# EAGLE design shield nodemcu (EAGLE 7.2.0)
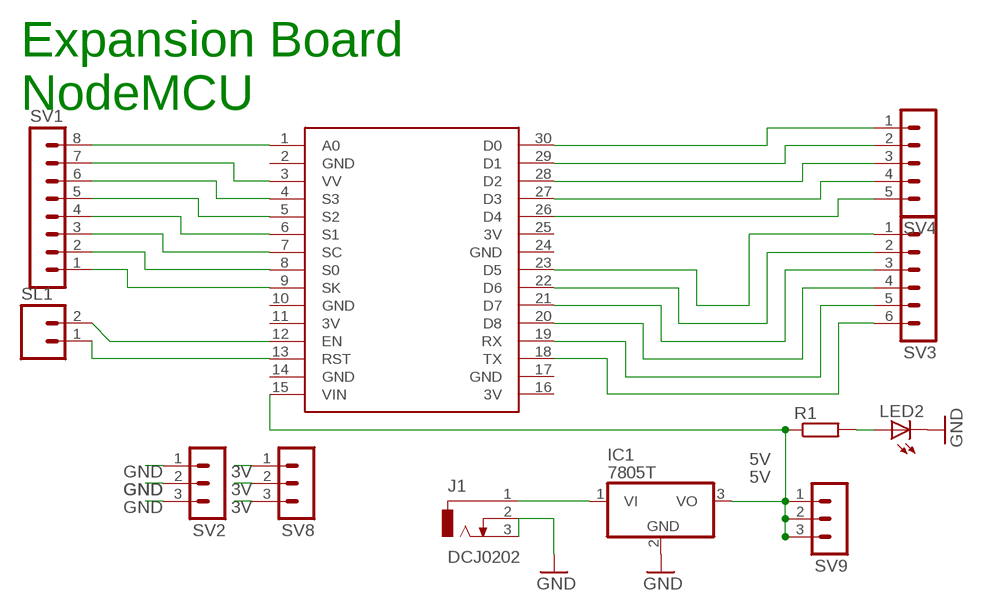
[diagram p0: schematic, sheet 1]

## Parts
IC1  7805T  [TO220H]
J1  DCJ0202  [DCJ0202]
LED2  LED5MM  [LED5MM]
R1  R-EU_0207/10  [0207/10]
SL1  M02  [02P]
SV1  MA08-1  [MA08-1]
SV2  MA03-1  [MA03-1]
SV3  MA06-1  [MA06-1]
SV4  MA05-1  [MA05-1]
SV8  MA03-1  [MA03-1]
SV9  MA03-1  [MA03-1]
U$1  NODEMCU  [NODEMCU]

## Nets
3V: SV8.1 SV8.2 SV8.3
5V: IC1.3(VO) R1.1 SV9.1 SV9.2 SV9.3 U$1.15(VIN)
GND: IC1.2(GND) J1.2 J1.3 LED2.K(C) SV2.1 SV2.2 SV2.3
N$3: SV4.5 U$1.26(D4)
N$4: SV1.8 U$1.1(A0)
N$5: SV1.7 U$1.3(VV)
N$6: SV1.6 U$1.4(S3)
N$7: SV1.5 U$1.5(S2)
N$8: LED2.A R1.2
N$9: SV1.3 U$1.7(SC)
N$10: IC1.1(VI) J1.1
N$11: SV1.1 U$1.9(SK)
N$12: SL1.1 U$1.13(RST)
N$13: SL1.2 U$1.12(EN)
N$14: SV4.1 U$1.30(D0)
N$15: SV4.2 U$1.29(D1)
N$16: SV4.3 U$1.28(D2)
N$17: SV4.4 U$1.27(D3)
N$18: SV3.1 U$1.23(D5)
N$19: SV3.2 U$1.22(D6)
N$20: SV3.3 U$1.21(D7)
N$21: SV3.4 U$1.20(D8)
N$22: SV3.5 U$1.19(RX)
N$23: SV3.6 U$1.18(TX)
N$28: SV1.4 U$1.6(S1)
N$29: SV1.2 U$1.8(S0)

## Notes on the sheet
- Expansion Board
- NodeMCU

## Power pins joined to a net without a drawn wire
3V: U$1.11(3V) U$1.16(3V) U$1.25(3V)
GND: U$1.2(GND) U$1.10(GND) U$1.14(GND) U$1.17(GND) U$1.24(GND)

## Library data of the parts
IC1 = linear:78*: Positive VOLTAGE REGULATOR Source: http://cache.national.com/ds/LM/LM78L05.pdf http://www.fairchildsemi.com/ds/LM/LM7805.pdf
J1 = con-jack:DCJ0202: DC POWER JACK Source: DCJ0202.pdf; OC_FARNELL: unknown; OC_NEWARK: unknown
LED2 = led:LED: LED OSRAM: - CHIPLED LG R971, LG N971, LY N971, LG Q971, LY Q971, LO R971, LY R971 LH N974, LH R974 LS Q976, LO Q976, LY Q976 LO Q996 - Hyper CHIPLED LW Q18S LB Q993, LB Q99A, LB R99A - SideLED LS A670, LO A670, LY A670, LG A670, LP A670 LB A673, LV A673, LT A673, LW A673 LH A674 LY A675 LS A676, LA A676, LO A676, LY A676, LW A676 LS A679, LY A679, LG A679 - Hyper Micro SIDELED® LS Y876, LA Y876, LO Y876, LY Y876 LT Y87S - SmartLED LW L88C, LW L88S LB L89C, LB L89S, LG L890 LS L89K, LO L89K, LY L89K LS L896, LA L896, LO L896, LY L896 - TOPLED LS T670, LO T670, LY T670, LG T670, LP T670 LSG T670, LSP T670, LSY T670, LOP T670, LYG T670 LG T671, LOG T671, LSG T671 LB T673, LV T673, LT T673, LW T673 LH T674 LS T676, LA T676, LO T676, LY T676, LB T676, LH T676, LSB T676, LW T676 LB T67C, LV T67C, LT T67C, LS T67K, LO T67K, LY T67K, LW E67C LS E67B, LA E67B, LO E67B, LY E67B, LB E67C, LV E67C, LT E67C LW T67C LS T679, LY T679, LG T679 LS T770, LO T770, LY T770, LG T770, LP T770 LB T773, LV T773, LT T773, LW T773 LH T774 LS E675, LA E675, LY E675, LS T675 LS T776, LA T776, LO T776, LY T776, LB T776 LHGB T686 LT T68C, LB T68C - Hyper Mini TOPLED® LB M676 - Mini TOPLED Santana® LG M470 LS M47K, LO M47K, LY M47K Source: http://www.osram.convergy.de LUXEON: - LUMILED® LXK2-PW12-R00, LXK2-PW12-S00, LXK2-PW14-U00, LXK2-PW14-V00 LXK2-PM12-R00, LXK2-PM12-S00, LXK2-PM14-U00 LXK2-PE12-Q00, LXK2-PE12-R00, LXK2-PE12-S00, LXK2-PE14-T00, LXK2-PE14-U00 LXK2-PB12-K00, LXK2-PB12-L00, LXK2-PB12-M00, LXK2-PB14-N00, LXK2-PB14-P00, LXK2-PB14-Q00 LXK2-PR12-L00, LXK2-PR12-M00, LXK2-PR14-Q00, LXK2-PR14-R00 LXK2-PD12-Q00, LXK2-PD12-R00, LXK2-PD12-S00 LXK2-PH12-R00, LXK2-PH12-S00 LXK2-PL12-P00, LXK2-PL12-Q00, LXK2-PL12-R00 Source: www.luxeon.com KINGBRIGHT: KA-3528ASYC Source: www.kingbright.com
R1 = resistor:R-EU_: RESISTOR, European symbol
SL1 = con-amp-quick:M02: AMP QUICK CONNECTOR; OC_FARNELL: unknown; OC_NEWARK: unknown
SV1 = con-lstb:MA08-1: PIN HEADER; OC_FARNELL: unknown; OC_NEWARK: unknown
SV2 SV8 SV9 = con-lstb:MA03-1: PIN HEADER; OC_FARNELL: unknown; OC_NEWARK: unknown
SV3 = con-lstb:MA06-1: PIN HEADER; OC_FARNELL: unknown; OC_NEWARK: unknown
SV4 = con-lstb:MA05-1: PIN HEADER; OC_FARNELL: unknown; OC_NEWARK: unknown
U$1 = nodemcu:NODEMCU

## Board
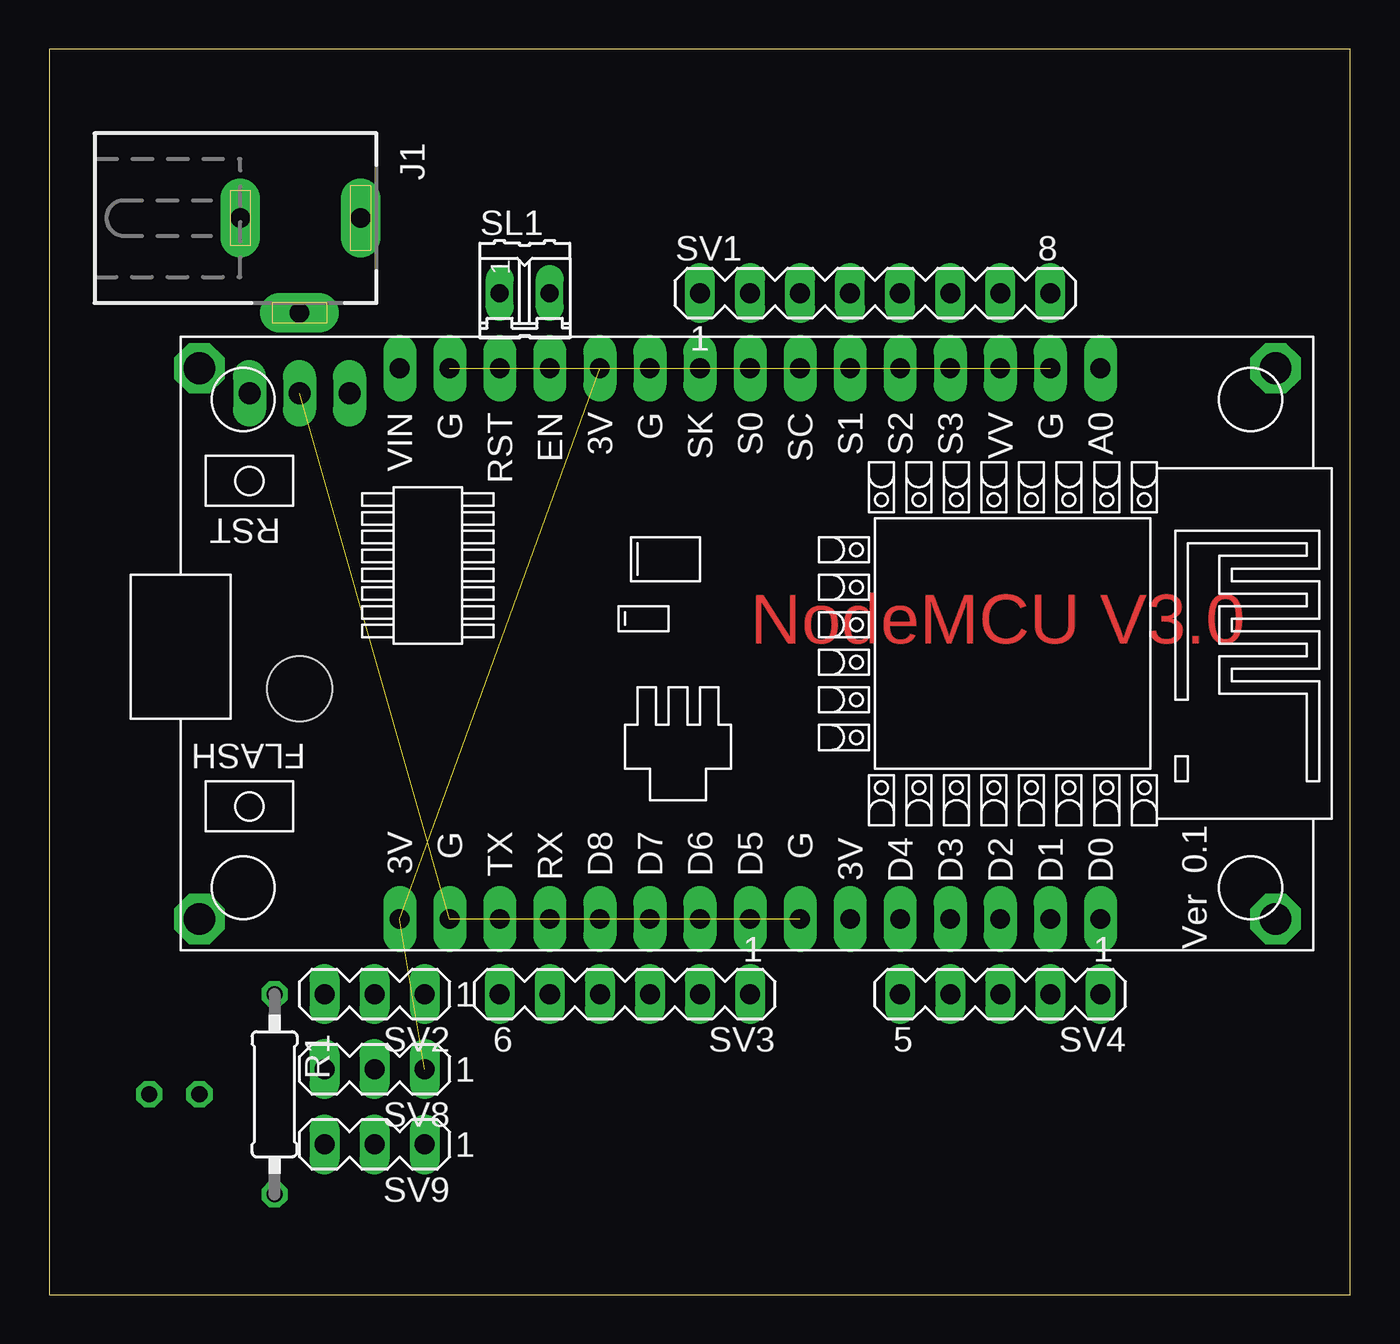
[diagram p1: board, top side]
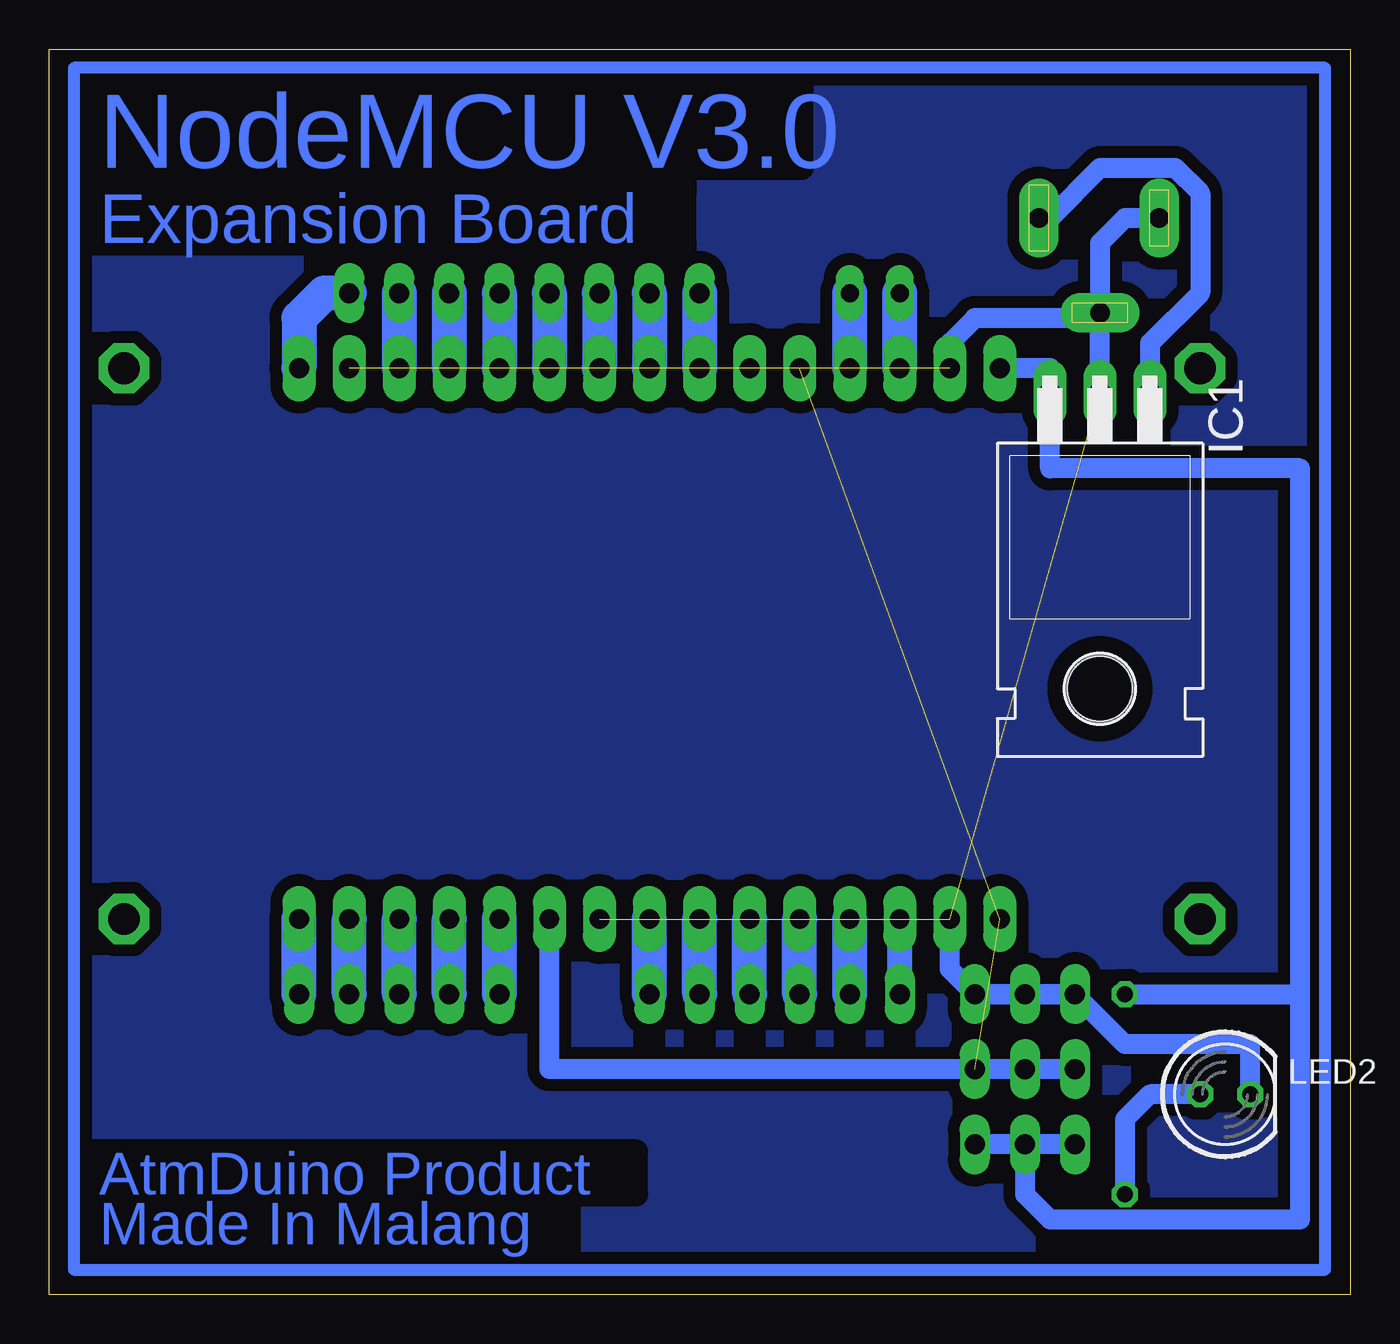
[diagram p2: board, bottom side, seen from below]

Size 66.02 x 63.17 mm. Coordinates in mm from the lower left corner, seen from the top.
Outline: 0,0 66.02,0 66.02,63.17 0,63.17 0,0
Copper layers (1*16): Top 0.035mm / dielectric 1.5mm / Bottom 0.035mm
Design rules "default": minimum track width 10mil, minimum drill 24mil, track to track 8mil, track to pad 8mil, pad to pad 8mil, via to via 8mil, smd to smd 8mil, copper to edge 40mil, drill to drill 8mil, minimum pad ring 10mil, minimum via ring 8mil, stop-mask expansion 4mil, vias tented up to drill 0mil, thermal gap 10mil

### Footprints (pad centres in the part's own frame; a part is rotated, then mirrored left to right if it is on the bottom)
TO220H = drill 1.118 long: 1 -2.54,-10.16; 2 0,-10.16; 3 2.54,-10.16 | hole 3.302: 0,4.826
DCJ0202 = drill 1 pad 2 long: 1 0,3.1; 2 4.8,0; 3 0,-3
LED5MM = drill 0.813 octagon: A -1.27,0; K 1.27,0
0207/10 = drill 0.813 octagon: 1 -5.08,0; 2 5.08,0
02P = drill 0.914 long: 1 -1.27,0; 2 1.27,0
MA08-1 = drill 1.016 long: 1 -8.89,0; 2 -6.35,0; 3 -3.81,0; 4 -1.27,0; 5 1.27,0; 6 3.81,0; 7 6.35,0; 8 8.89,0
MA03-1 = drill 1.016 long: 1 -2.54,0; 2 0,0; 3 2.54,0
MA06-1 = drill 1.016 long: 1 -6.35,0; 2 -3.81,0; 3 -1.27,0; 4 1.27,0; 5 3.81,0; 6 6.35,0
MA05-1 = drill 1.016 long: 1 -5.08,0; 2 -2.54,0; 3 0,0; 4 2.54,0; 5 5.08,0
NODEMCU = drill 1 pad 1.676 long: 1 -13.97,17.78; 2 -13.97,15.24; 3 -13.97,12.7; 4 -13.97,10.16; 5 -13.97,7.62; 6 -13.97,5.08; 7 -13.97,2.54; 8 -13.97,0; 9 -13.97,-2.54; 10 -13.97,-5.08; 11 -13.97,-7.62; 12 -13.97,-10.16; 13 -13.97,-12.7; 14 -13.97,-15.24; 15 -13.97,-17.78; 16 13.97,-17.78; 17 13.97,-15.24; 18 13.97,-12.7; 19 13.97,-10.16; 20 13.97,-7.62; 21 13.97,-5.08; 22 13.97,-2.54; 23 13.97,0; 24 13.97,2.54; 25 13.97,5.08; 26 13.97,7.62; 27 13.97,10.16; 28 13.97,12.7; 29 13.97,15.24; 30 13.97,17.78

### Placement (x,y rotation side)
IC1  12.7,35.56 180 bottom
J1  12.7,54.61 270 top
LED2  6.35,10.16 0 bottom
R1  11.43,10.16 270 top
SL1  24.13,50.8 0 top
SV1  41.91,50.8 0 top
SV2  16.51,15.24 180 top
SV3  29.21,15.24 180 top
SV4  48.26,15.24 180 top
SV8  16.51,11.43 180 top
SV9  16.51,7.62 180 top
U$1  35.56,33.02 270 top

### Tracks (layer width: path | path; a pad name or v marks a point on that pad's centre or on a via)
3V  (2 unrouted)
  Bottom 1.016: SV8.3 SV8.2 SV8.1 40.64,11.43 U$1.25
5V
  Bottom 1.016: U$1.15 15.24,46.99 IC1.3 15.24,41.91 2.54,41.91 2.54,15.24 | SV9.2 SV9.1 | SV9.3 SV9.2 | SV9.2 16.51,5.08 15.24,3.81 2.54,3.81 2.54,15.24 | R1.1 2.54,15.24
GND  (4 unrouted)
  Bottom 1.016: 12.7,49.53 J1.2 12.7,53.34 11.43,54.61 J1.3 | SV2.1 SV2.2 SV2.3 | SV2.3 SV2.1 | SV2.1 20.32,16.51 U$1.17 | LED2.K 5.08,12.7 11.43,12.7 SV2.3 | IC1.2 12.7,49.53 | 12.7,49.53 19.05,49.53 20.32,48.26 U$1.14
N$1
  pour Bottom (isolate 0.61): 64.77,1.27 64.77,62.23 1.27,62.23 1.27,1.27
N$2  (via drill 1.6 pad 2.54)
  other vias: 7.62,46.99
N$3
  Bottom 1.778: SV4.5 U$1.26
N$4
  Bottom 1.778: SV1.8 52.07,50.8 53.34,49.53 U$1.1
N$5
  Bottom 1.778: SV1.7 U$1.3
N$6
  Bottom 1.778: SV1.6 U$1.4
N$7
  Bottom 1.778: SV1.5 U$1.5
N$8
  Bottom 1.016: LED2.A 10.16,10.16 11.43,8.89 R1.2
N$9
  Bottom 1.778: SV1.3 U$1.7
N$10
  Bottom 1.016: J1.1 15.24,54.61 12.7,57.15 8.89,57.15 7.62,55.88 7.62,50.8 10.16,48.26 IC1.1
N$11
  Bottom 1.778: SV1.1 U$1.9
N$12
  Bottom 1.778: U$1.13 SL1.1
N$13
  Bottom 1.778: U$1.12 SL1.2
N$14
  Bottom 1.778: SV4.1 U$1.30
N$15
  Bottom 1.778: SV4.2 U$1.29
N$16
  Bottom 1.778: SV4.3 U$1.28
N$17
  Bottom 1.778: SV4.4 U$1.27
N$18
  Bottom 1.778: SV3.1 U$1.23
N$19
  Bottom 1.778: SV3.2 U$1.22
N$20
  Bottom 1.778: SV3.3 U$1.21
N$21
  Bottom 1.778: SV3.4 U$1.20
N$22
  Bottom 1.778: SV3.5 U$1.19
N$23
  Bottom 1.27: SV3.6 U$1.18
N$24  (via drill 1.6 pad 2.54)
  other vias: 7.62,19.05
N$25  (via drill 1.6 pad 2.54)
  other vias: 62.23,19.05
N$26
  Bottom 0.61: 1.27,62.23 64.77,62.23 64.77,1.27 1.27,1.27 1.27,62.23
N$27  (via drill 1.6 pad 2.54)
  other vias: 62.23,46.99
N$28
  Bottom 1.778: SV1.4 U$1.6
N$29
  Bottom 1.778: SV1.2 U$1.8

### Text on the board
Top: NodeMCU V3.0
Bottom: NodeMCU V3.0 | Expansion Board | AtmDuino Product | Made In Malang